# Altium project Gator Stream Transmitter.PrjPCB
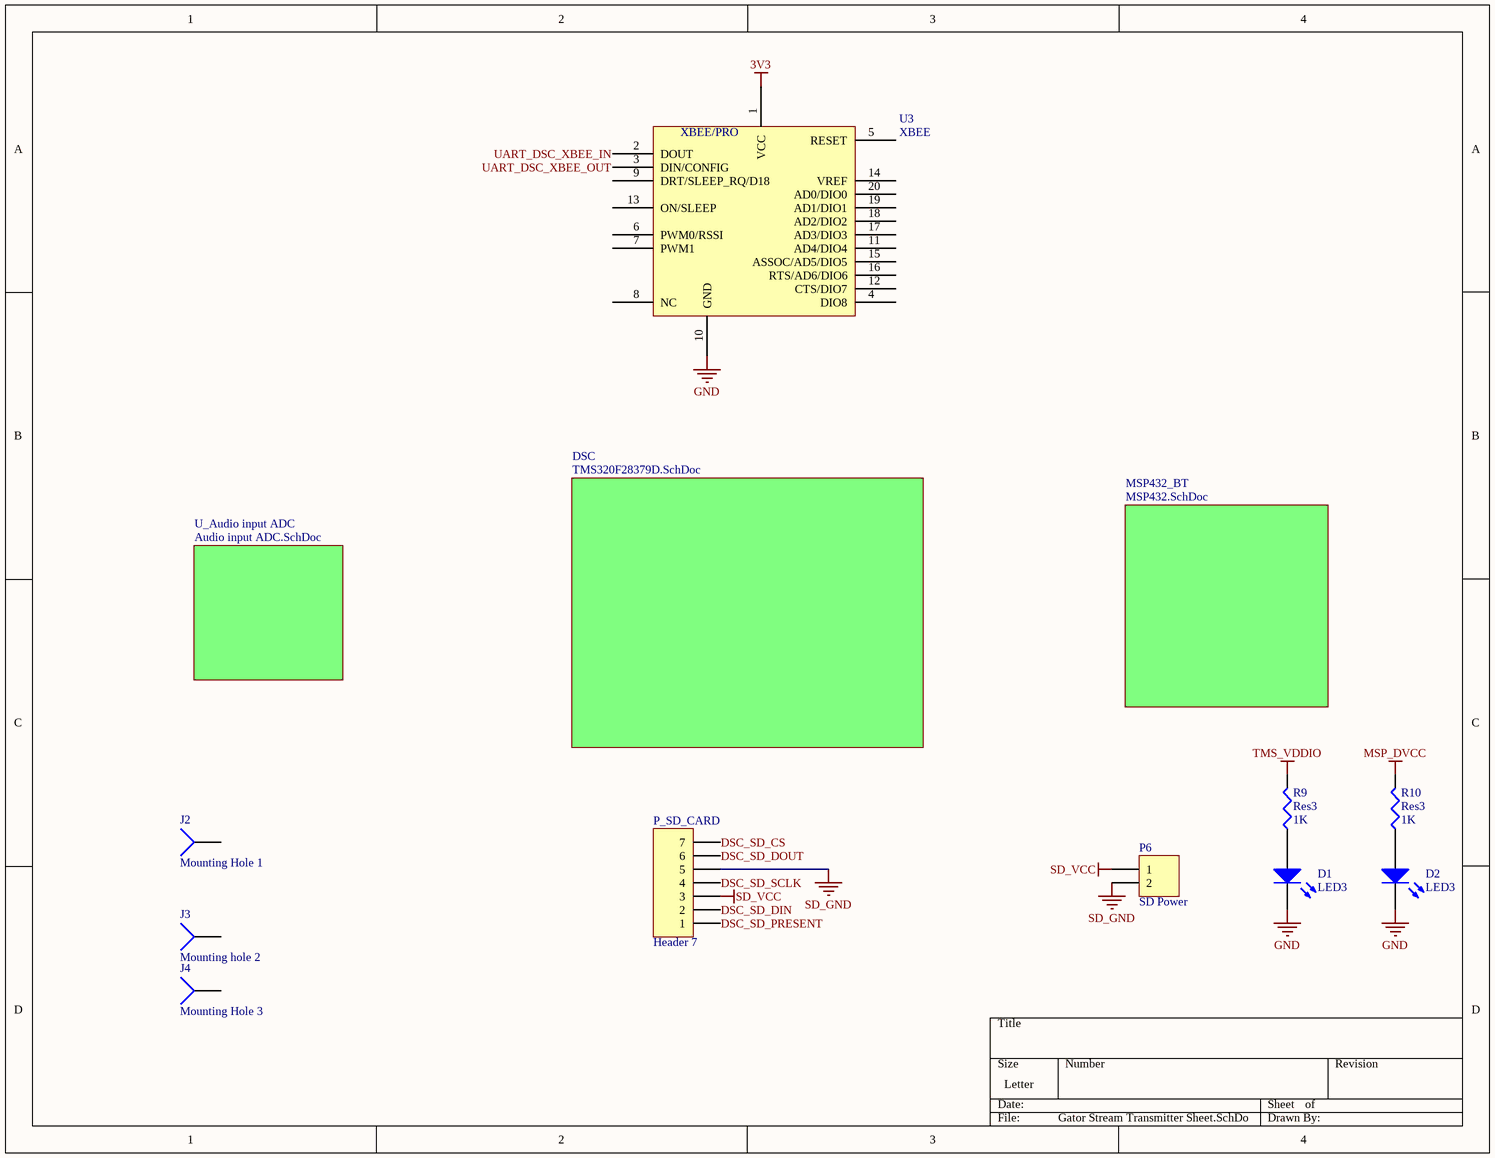
[diagram p0: Gator Stream Transmitter Sheet.SchDoc]
4 sheets, 80 parts. Net scope: global (net labels, ports and power ports of the same name join across sheets).
Board file: Gator Stream Transmitter.PcbDoc
Sheets:
  Gator Stream Transmitter Sheet.SchDoc
    MSP432_BT = MSP432.SchDoc
    DSC = TMS320F28379D.SchDoc
    U_Audio input ADC = Audio input ADC.SchDoc

## Sheet Gator Stream Transmitter Sheet.SchDoc
size Letter

### Parts
D1  LED3  [3.5X2.8X1.9]
D2  LED3  [3.5X2.8X1.9]
J2  Mounting Hole 1  [PIN1]
J3  Mounting hole 2  [PIN1]
J4  Mounting Hole 3  [PIN1]
P6  SD Power  [HDR1X2]
P_SD_CARD  Header 7  [HDR1X7]
R9  Res3  value 1K  [14-1210]
R10  Res3  value 1K  [14-1210]
U3  XBEE  [XBEE/PRO]

### Sub-sheets
DSC = TMS320F28379D.SchDoc: no entries
MSP432_BT = MSP432.SchDoc: no entries
U_Audio input ADC = Audio input ADC.SchDoc: no entries

### Nets
3V3: R10.2 U3.1(VCC)  [also labelled MSP_DVCC]
GND: D1.2(K) D2.2(K) U3.10(GND)
SD_GND: P6.2 P_SD_CARD.5
SD_VCC: P6.1 P_SD_CARD.3
TMS_VDDIO: R9.2
DSC_SD_CS: P_SD_CARD.7
DSC_SD_DIN: P_SD_CARD.2
DSC_SD_DOUT: P_SD_CARD.6
DSC_SD_PRESENT: P_SD_CARD.1
DSC_SD_SCLK: P_SD_CARD.4
UART_DSC_XBEE_IN: U3.2(DOUT)
UART_DSC_XBEE_OUT: U3.3(DIN/CONFIG)
NetD1_1: D1.1(A) R9.1
NetD2_1: D2.1(A) R10.1

Not connected (* = marked no-connect by the designer): J2 1; J3 1; J4 1; U3 4(DIO8) 5(RESET) 6(PWM0/RSSI) 7(PWM1) 8(NC) 9(DRT/SLEEP_RQ/D18) 11(AD4/DIO4) 12(CTS/DIO7) 13(ON/SLEEP) 14(VREF) 15(ASSOC/AD5/DIO5) 16(RTS/AD6/DIO6) 17(AD3/DIO3) 18(AD2/DIO2) 19(AD1/DIO1) 20(AD0/DIO0)

### Notes on the sheet
- (in symbol XBEE) XBEE/PRO

### Library data of the parts
D1 D2 = LED3: Typical BLUE SiC LED; Published: 8-Jun-2000; LatestRevisionDate: 17-Dec-2003; LatestRevisionNote: PCB Footprint replaced.; DatasheetVersion: 16-Apr-2002; PackageVersion: 16-Apr-2002; PackageReference: 3.5X2.8X1.9; Publisher: Altium Limited; PackageDescription: SM LED; 2 C-Bend Leads; Body 3.5 x 2.8 x 1.9 mm, inc leads (LxWxH typ)
J2-J4 = Socket: LatestRevisionDate: 17-Jul-2002; LatestRevisionNote: Re-released for DXP Platform.; Publisher: Altium Limited
P6 = Header 2: Header, 2-Pin; LatestRevisionDate: 17-Jul-2002; LatestRevisionNote: Re-released for DXP Platform.; Publisher: Altium Limited
P_SD_CARD = Header 7: Header, 7-Pin; LatestRevisionDate: 17-Jul-2002; LatestRevisionNote: Re-released for DXP Platform.; Publisher: Altium Limited
R9 R10 = Res3: Resistor; Published: 8-Jun-2000; LatestRevisionDate: 29-May-2009; LatestRevisionNote: IPC-7351 Footprint Added.; PackageReference: J1-0603; Publisher: Altium Limited; PackageDescription: Chip Resistor

## Sheet MSP432.SchDoc
size Letter
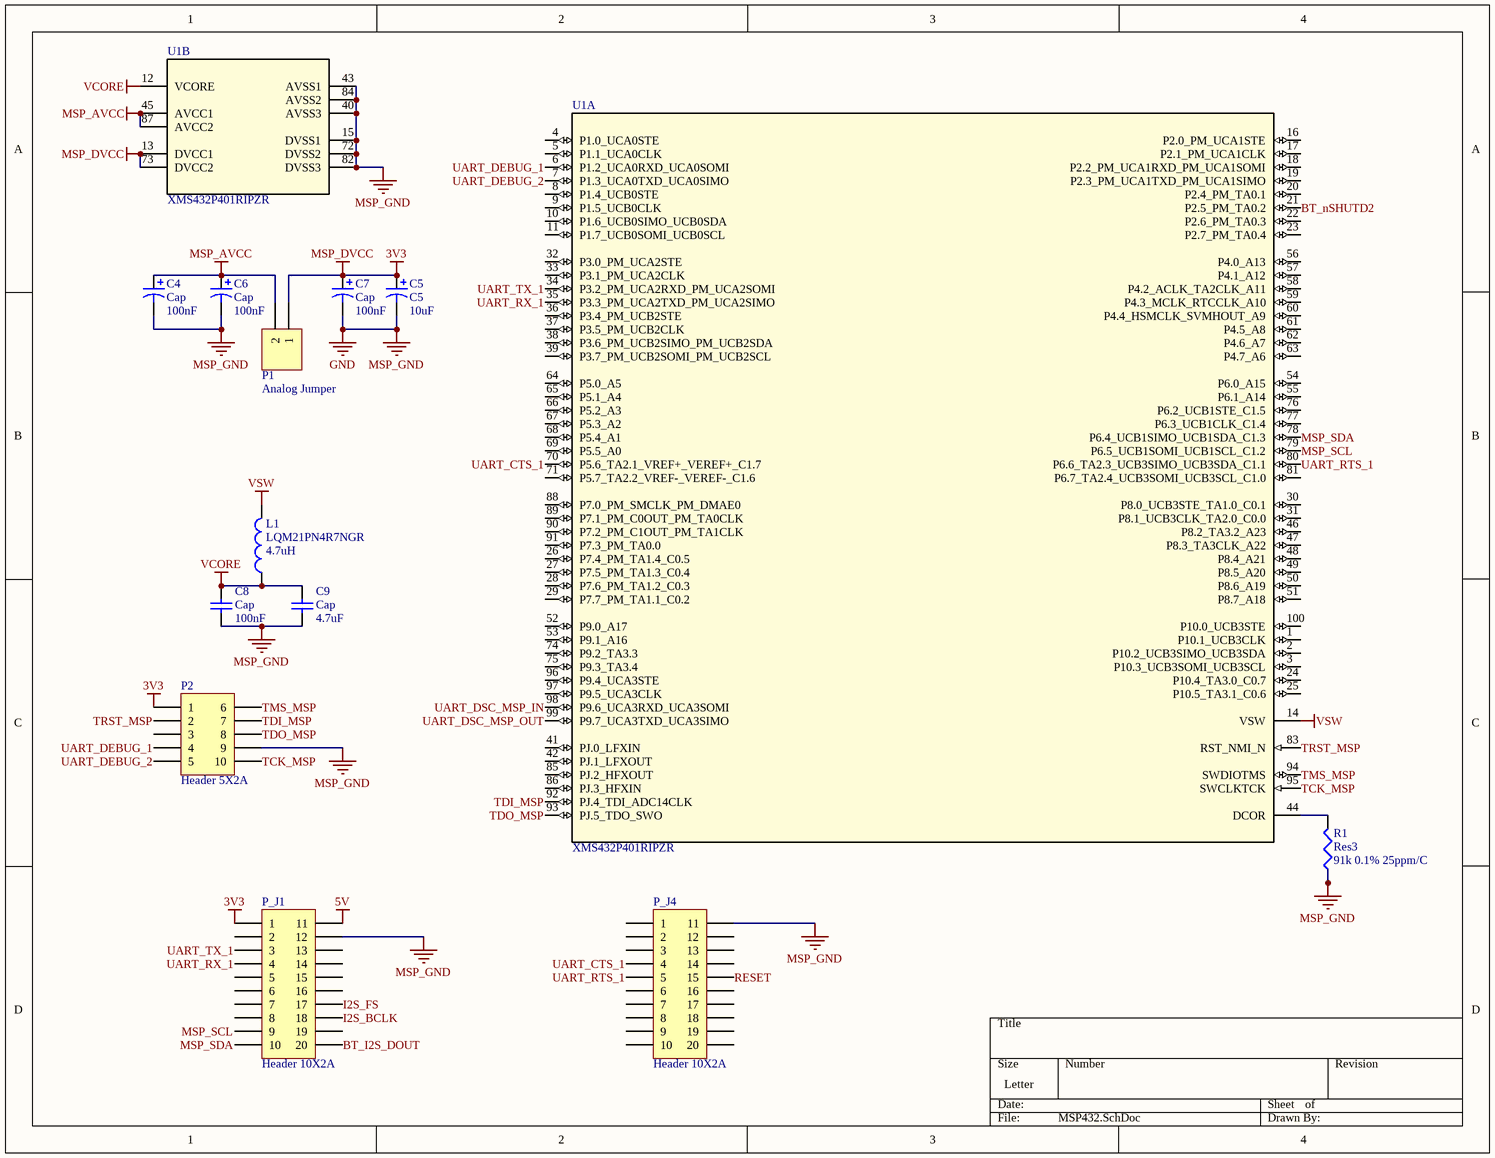
[diagram p1: MSP432.SchDoc]

### Parts
C4  Cap  value 100nF  [C0805]
C5  C5  value 10uF  [C0805]
C6  Cap  value 100nF  [C0805]
C7  Cap  value 100nF  [C0805]
C8  Cap  value 100nF  [C0805]
C9  Cap  value 4.7uF  [C0805]
L1  LQM21PN4R7NGR  value 4.7uH  [6-0805_N]
P1  Analog Jumper  [HDR1X2]
P2  Header 5X2A  [HDR2X5_CEN]
P_J1  Header 10X2A  [HDR2X10_CEN]
P_J4  Header 10X2A  [HDR2X10_CEN]
R1  Res3  value 91k 0.1% 25ppm/C  [14-1210]
U1  XMS432P401RIPZR  [PZ0100A_N]  (parts A,B of 2)

### Nets
3V3: C5.1 C7.1 P1.1 P2.1 P_J1.1 U1.13(DVCC1) U1.73(DVCC2)  [also labelled MSP_DVCC]
5V: P_J1.11
GND: C4.2 C5.2 C6.2 C7.2 C8.1 C9.2 P2.9 P_J1.12 P_J4.11 R1.1 U1.15(DVSS1) U1.40(AVSS3) U1.43(AVSS1) U1.72(DVSS2) U1.82(DVSS3) U1.84(AVSS2)  [also labelled MSP_GND]
MSP_AVCC: C4.1 C6.1 P1.2 U1.45(AVCC1) U1.87(AVCC2)
VCORE: C8.2 C9.1 L1.1 U1.12(VCORE)
VSW: L1.2 U1.14(VSW)
BT_I2S_DOUT: P_J1.20
BT_nSHUTD2: U1.21(P2.5_PM_TA0.2)
I2S_BCLK: P_J1.18
I2S_FS: P_J1.17
MSP_SCL: P_J1.9 U1.79(P6.5_UCB1SOMI_UCB1SCL_C1.2)
MSP_SDA: P_J1.10 U1.78(P6.4_UCB1SIMO_UCB1SDA_C1.3)
RESET: P_J4.15
TCK_MSP: P2.10 U1.95(SWCLKTCK)
TDI_MSP: P2.7 U1.92(PJ.4_TDI_ADC14CLK)
TDO_MSP: P2.8 U1.93(PJ.5_TDO_SWO)
TMS_MSP: P2.6 U1.94(SWDIOTMS)
TRST_MSP: P2.2 U1.83(RST_NMI_N)
UART_CTS_1: P_J4.4 U1.70(P5.6_TA2.1_VREF+_VEREF+_C1.7)
UART_DEBUG_1: P2.4 U1.6(P1.2_UCA0RXD_UCA0SOMI)
UART_DEBUG_2: P2.5 U1.7(P1.3_UCA0TXD_UCA0SIMO)
UART_DSC_MSP_IN: U1.98(P9.6_UCA3RXD_UCA3SOMI)
UART_DSC_MSP_OUT: U1.99(P9.7_UCA3TXD_UCA3SIMO)
UART_RTS_1: P_J4.5 U1.80(P6.6_TA2.3_UCB3SIMO_UCB3SDA_C1.1)
UART_RX_1: P_J1.4 U1.35(P3.3_PM_UCA2TXD_PM_UCA2SIMO)
UART_TX_1: P_J1.3 U1.34(P3.2_PM_UCA2RXD_PM_UCA2SOMI)
NetR1_2: R1.2 U1.44(DCOR)

Not connected (* = marked no-connect by the designer): P2 3; P_J1 2 5 6 7 8 13 14 15 16 19; P_J4 1 2 3 6 7 8 9 10 12 13 14 16 17 18 19 20; U1 1(P10.1_UCB3CLK) 2(P10.2_UCB3SIMO_UCB3SDA) 3(P10.3_UCB3SOMI_UCB3SCL) 4(P1.0_UCA0STE) 5(P1.1_UCA0CLK) 8(P1.4_UCB0STE) 9(P1.5_UCB0CLK) 10(P1.6_UCB0SIMO_UCB0SDA) 11(P1.7_UCB0SOMI_UCB0SCL) 16(P2.0_PM_UCA1STE) 17(P2.1_PM_UCA1CLK) 18(P2.2_PM_UCA1RXD_PM_UCA1SOMI) 19(P2.3_PM_UCA1TXD_PM_UCA1SIMO) 20(P2.4_PM_TA0.1) 22(P2.6_PM_TA0.3) 23(P2.7_PM_TA0.4) 24(P10.4_TA3.0_C0.7) 25(P10.5_TA3.1_C0.6) 26(P7.4_PM_TA1.4_C0.5) 27(P7.5_PM_TA1.3_C0.4) 28(P7.6_PM_TA1.2_C0.3) 29(P7.7_PM_TA1.1_C0.2) 30(P8.0_UCB3STE_TA1.0_C0.1) 31(P8.1_UCB3CLK_TA2.0_C0.0) 32(P3.0_PM_UCA2STE) 33(P3.1_PM_UCA2CLK) 36(P3.4_PM_UCB2STE) 37(P3.5_PM_UCB2CLK) 38(P3.6_PM_UCB2SIMO_PM_UCB2SDA) 39(P3.7_PM_UCB2SOMI_PM_UCB2SCL) 41(PJ.0_LFXIN) 42(PJ.1_LFXOUT) 46(P8.2_TA3.2_A23) 47(P8.3_TA3CLK_A22) 48(P8.4_A21) 49(P8.5_A20) 50(P8.6_A19) 51(P8.7_A18) 52(P9.0_A17) 53(P9.1_A16) 54(P6.0_A15) 55(P6.1_A14) 56(P4.0_A13) 57(P4.1_A12) 58(P4.2_ACLK_TA2CLK_A11) 59(P4.3_MCLK_RTCCLK_A10) 60(P4.4_HSMCLK_SVMHOUT_A9) 61(P4.5_A8) 62(P4.6_A7) 63(P4.7_A6) 64(P5.0_A5) 65(P5.1_A4) 66(P5.2_A3) 67(P5.3_A2) 68(P5.4_A1) 69(P5.5_A0) 71(P5.7_TA2.2_VREF-_VEREF-_C1.6) 74(P9.2_TA3.3) 75(P9.3_TA3.4) 76(P6.2_UCB1STE_C1.5) 77(P6.3_UCB1CLK_C1.4) 81(P6.7_TA2.4_UCB3SOMI_UCB3SCL_C1.0) 85(PJ.2_HFXOUT) 86(PJ.3_HFXIN) 88(P7.0_PM_SMCLK_PM_DMAE0) 89(P7.1_PM_C0OUT_PM_TA0CLK) 90(P7.2_PM_C1OUT_PM_TA1CLK) 91(P7.3_PM_TA0.0) 96(P9.4_UCA3STE) 97(P9.5_UCA3CLK) 100(P10.0_UCB3STE)

### Library data of the parts
C4-C7 = Cap Pol3: Polarized Capacitor (Surface Mount); Published: 8-Jun-2000; LatestRevisionDate: 29-May-2009; LatestRevisionNote: IPC-7351 Footprint Added.; PackageReference: C0805; Publisher: Altium Limited; PackageDescription: Chip Capacitor
C8 C9 = Cap Semi: Capacitor (Semiconductor SIM Model); Published: 8-Jun-2000; LatestRevisionDate: 29-May-2009; LatestRevisionNote: IPC-7351 Footprint Added.; PackageReference: C1206; Publisher: Altium Limited; PackageDescription: Chip Capacitor
L1 = Inductor: Code_IEC: 1005; Published: 8-Jun-2000; LatestRevisionDate: 29-May-2009; LatestRevisionNote: IPC-7351 Footprint Added.; PackageReference: 0402-A; Publisher: Altium Limited; PackageDescription: Chip Inductor; Code_JEITA: 0402
P1 = Header 2: Header, 2-Pin; LatestRevisionDate: 17-Jul-2002; LatestRevisionNote: Re-released for DXP Platform.; Publisher: Altium Limited
P2 = Header 5X2A: Header, 5-Pin, Dual row; LatestRevisionDate: 17-Jul-2002; LatestRevisionNote: Re-released for DXP Platform.; Publisher: Altium Limited
P_J1 P_J4 = Header 10X2A: Header, 10-Pin, Dual row; LatestRevisionDate: 17-Jul-2002; LatestRevisionNote: Re-released for DXP Platform.; Publisher: Altium Limited
R1 = Res3: Resistor; Published: 8-Jun-2000; LatestRevisionDate: 29-May-2009; LatestRevisionNote: IPC-7351 Footprint Added.; PackageReference: J1-0603; Publisher: Altium Limited; PackageDescription: Chip Resistor
U1 = XMS432P401RIPZR: Imported; Manufacturer: Texas Instruments; CompType: IC; PIN_COUNT: 100; PartNumber: XMS432P401RIPZR; PackageReference: PZ0100A; MountType: SMT; RefDes: RefDes; TYPE: TYPE; Value: Value

## Sheet TMS320F28379D.SchDoc
size Letter
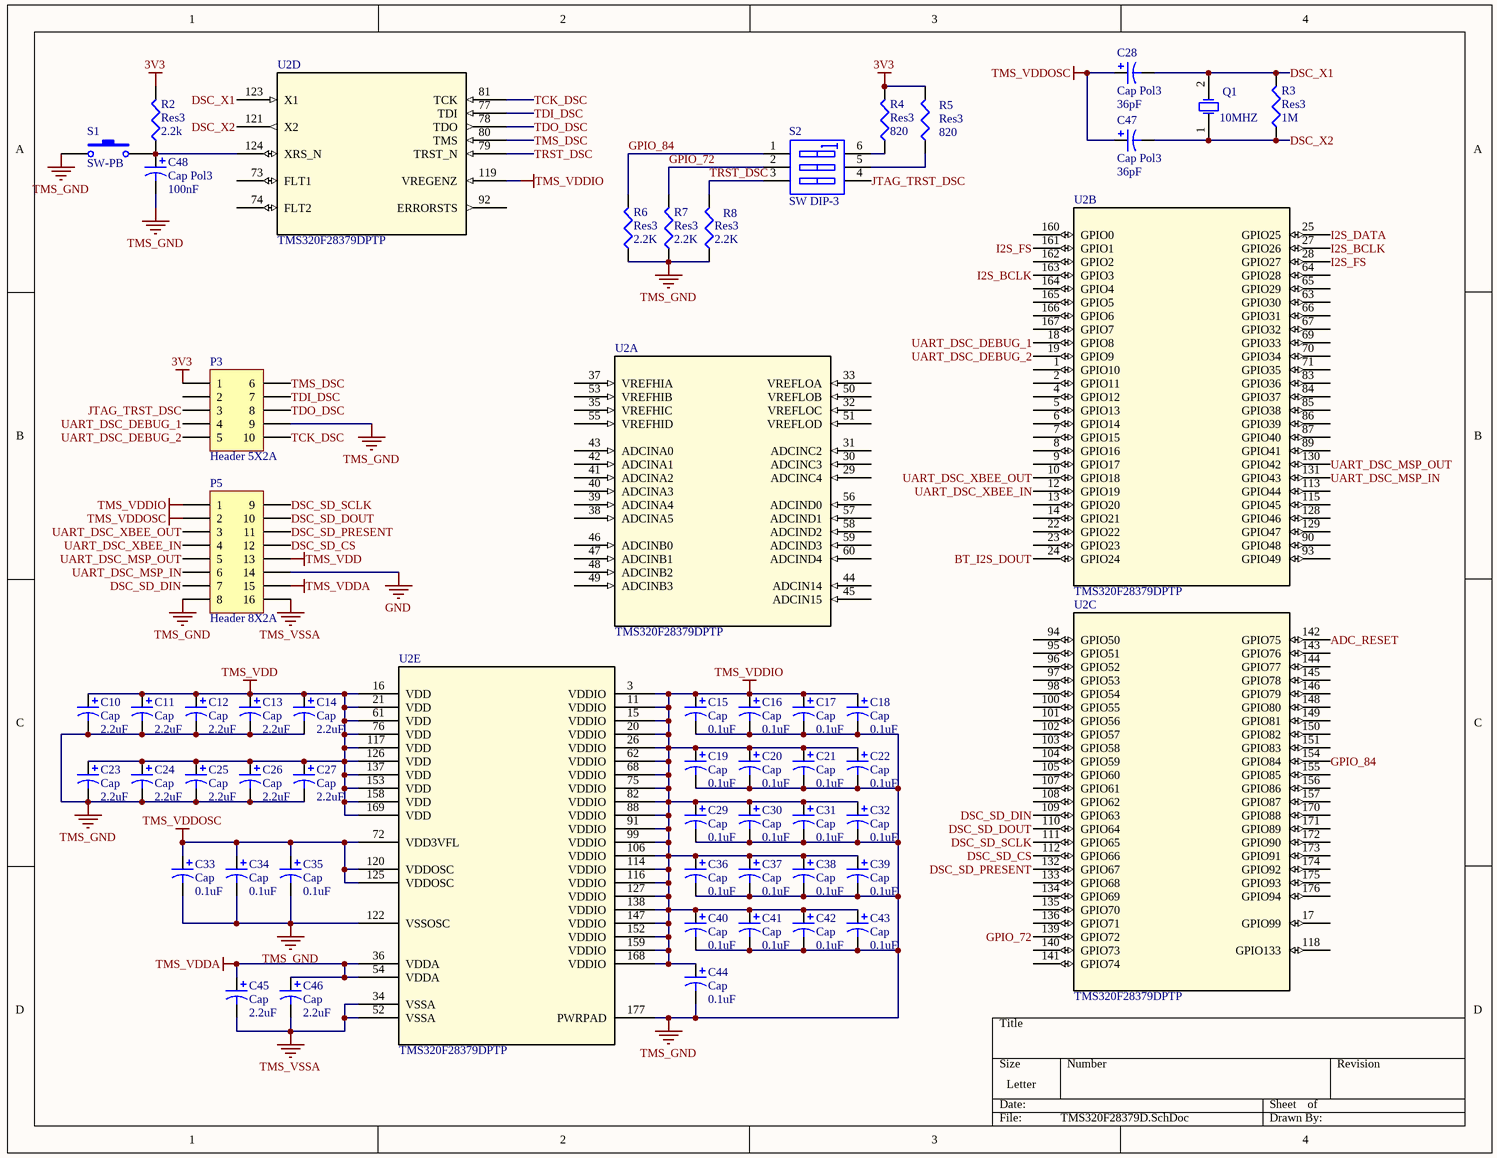
[diagram p2: TMS320F28379D.SchDoc]

### Parts
C10  Cap  value 2.2uF  [C0805]
C11  Cap  value 2.2uF  [C0805]
C12  Cap  value 2.2uF  [C0805]
C13  Cap  value 2.2uF  [C0805]
C14  Cap  value 2.2uF  [C0805]
C15  Cap  value 0.1uF  [C0805]
C16  Cap  value 0.1uF  [C0805]
C17  Cap  value 0.1uF  [C0805]
C18  Cap  value 0.1uF  [C0805]
C19  Cap  value 0.1uF  [C0805]
C20  Cap  value 0.1uF  [C0805]
C21  Cap  value 0.1uF  [C0805]
C22  Cap  value 0.1uF  [C0805]
C23  Cap  value 2.2uF  [C0805]
C24  Cap  value 2.2uF  [C0805]
C25  Cap  value 2.2uF  [C0805]
C26  Cap  value 2.2uF  [C0805]
C27  Cap  value 2.2uF  [C0805]
C28  Cap Pol3  value 36pF  [C0805]
C29  Cap  value 0.1uF  [C0805]
C30  Cap  value 0.1uF  [C0805]
C31  Cap  value 0.1uF  [C0805]
C32  Cap  value 0.1uF  [C0805]
C33  Cap  value 0.1uF  [C0805]
C34  Cap  value 0.1uF  [C0805]
C35  Cap  value 0.1uF  [C0805]
C36  Cap  value 0.1uF  [C0805]
C37  Cap  value 0.1uF  [C0805]
C38  Cap  value 0.1uF  [C0805]
C39  Cap  value 0.1uF  [C0805]
C40  Cap  value 0.1uF  [C0805]
C41  Cap  value 0.1uF  [C0805]
C42  Cap  value 0.1uF  [C0805]
C43  Cap  value 0.1uF  [C0805]
C44  Cap  value 0.1uF  [C0805]
C45  Cap  value 2.2uF  [C0805]
C46  Cap  value 2.2uF  [C0805]
C47  Cap Pol3  value 36pF  [C0805]
C48  Cap Pol3  value 100nF  [C0805]
P3  Header 5X2A  [HDR2X5_CEN]
P5  Header 8X2A  [HDR2X8_CEN]
Q1  10MHZ  [HC-49U]
R2  Res3  value 2.2k  [14-1210]
R3  Res3  value 1M  [14-1210]
R4  Res3  value 820  [14-1210]
R5  Res3  value 820  [14-1210]
R6  Res3  value 2.2K  [14-1210]
R7  Res3  value 2.2K  [14-1210]
R8  Res3  value 2.2K  [14-1210]
S1  SW-PB  [SW PB]
S2  SW DIP-3  [DIP-6]
U2  TMS320F28379DPTP  [PTP0176F_N]  (parts A,B,C,D,E of 5)

### Nets
3V3: P3.1 R2.2 R4.2 R5.2
GND: P5.14
TMS_GND: C10.2 C11.2 C12.2 C13.2 C14.2 C15.2 C16.2 C17.2 C18.2 C19.2 C20.2 C21.2 C22.2 C23.2 C24.2 C25.2 C26.2 C27.2 C29.2 C30.2 C31.2 C32.2 C33.2 C34.2 C35.2 C36.2 C37.2 C38.2 C39.2 C40.2 C41.2 C42.2 C43.2 C44.2 C48.2 P3.9 P5.8 R6.1 R7.1 R8.1 S1.1 U2.122(VSSOSC) U2.177(PWRPAD)
TMS_VDD: C10.1 C11.1 C12.1 C13.1 C14.1 C23.1 C24.1 C25.1 C26.1 C27.1 P5.13 U2.16(VDD) U2.21(VDD) U2.61(VDD) U2.76(VDD) U2.117(VDD) U2.126(VDD) U2.137(VDD) U2.153(VDD) U2.158(VDD) U2.169(VDD)
TMS_VDDA: C45.1 C46.1 P5.15 U2.36(VDDA) U2.54(VDDA)
TMS_VDDIO: C15.1 C16.1 C17.1 C18.1 C19.1 C20.1 C21.1 C22.1 C29.1 C30.1 C31.1 C32.1 C36.1 C37.1 C38.1 C39.1 C40.1 C41.1 C42.1 C43.1 C44.1 P5.1 U2.3(VDDIO) U2.11(VDDIO) U2.15(VDDIO) U2.20(VDDIO) U2.26(VDDIO) U2.62(VDDIO) U2.68(VDDIO) U2.75(VDDIO) U2.82(VDDIO) U2.88(VDDIO) U2.91(VDDIO) U2.99(VDDIO) U2.106(VDDIO) U2.114(VDDIO) U2.116(VDDIO) U2.119(VREGENZ) U2.127(VDDIO) U2.138(VDDIO) U2.147(VDDIO) U2.152(VDDIO) U2.159(VDDIO) U2.168(VDDIO)
TMS_VDDOSC: C28.1 C33.1 C34.1 C35.1 C47.1 P5.2 U2.72(VDD3VFL) U2.120(VDDOSC) U2.125(VDDOSC)
TMS_VSSA: C45.2 C46.2 P5.16 U2.34(VSSA) U2.52(VSSA)
ADC_RESET: U2.142(GPIO75)
BT_I2S_DOUT: U2.24(GPIO24)
DSC_SD_CS: P5.12 U2.112(GPIO66)
DSC_SD_DIN: P5.7 U2.109(GPIO63)
DSC_SD_DOUT: P5.10 U2.110(GPIO64)
DSC_SD_PRESENT: P5.11 U2.132(GPIO67)
DSC_SD_SCLK: P5.9 U2.111(GPIO65)
DSC_X1: C28.2 Q1.2(OSC2) R3.2 U2.123(X1)
DSC_X2: C47.2 Q1.1(OSC1) R3.1 U2.121(X2)
GPIO_72: R7.2 S2.2(A2) U2.139(GPIO72)
GPIO_84: R6.2 S2.1(A1) U2.154(GPIO84)
I2S_BCLK: U2.27(GPIO26) U2.163(GPIO3)
I2S_DATA: U2.25(GPIO25)
I2S_FS: U2.28(GPIO27) U2.161(GPIO1)
JTAG_TRST_DSC: P3.3 S2.4(B3)
TCK_DSC: P3.10 U2.81(TCK)
TDI_DSC: P3.7 U2.77(TDI)
TDO_DSC: P3.8 U2.78(TDO)
TMS_DSC: P3.6 U2.80(TMS)
TRST_DSC: R8.2 S2.3(A3) U2.79(TRST_N)
UART_DSC_DEBUG_1: P3.4 U2.18(GPIO8)
UART_DSC_DEBUG_2: P3.5 U2.19(GPIO9)
UART_DSC_MSP_IN: P5.6 U2.131(GPIO43)
UART_DSC_MSP_OUT: P5.5 U2.130(GPIO42)
UART_DSC_XBEE_IN: P5.4 U2.12(GPIO19)
UART_DSC_XBEE_OUT: P5.3 U2.10(GPIO18)
NetC48_1: C48.1 R2.1 S1.2 U2.124(XRS_N)
NetR4_1: R4.1 S2.6(B1)
NetR5_1: R5.1 S2.5(B2)

Not connected (* = marked no-connect by the designer): P3 2; U2 1(GPIO10) 2(GPIO11) 4(GPIO12) 5(GPIO13) 6(GPIO14) 7(GPIO15) 8(GPIO16) 9(GPIO17) 13(GPIO20) 14(GPIO21) 17(GPIO99) 22(GPIO22) 23(GPIO23) 29(ADCINC4) 30(ADCINC3) 31(ADCINC2) 32(VREFLOC) 33(VREFLOA) 35(VREFHIC) 37(VREFHIA) 38(ADCINA5) 39(ADCINA4) 40(ADCINA3) 41(ADCINA2) 42(ADCINA1) 43(ADCINA0) 44(ADCIN14) 45(ADCIN15) 46(ADCINB0) 47(ADCINB1) 48(ADCINB2) 49(ADCINB3) 50(VREFLOB) 51(VREFLOD) 53(VREFHIB) 55(VREFHID) 56(ADCIND0) 57(ADCIND1) 58(ADCIND2) 59(ADCIND3) 60(ADCIND4) 63(GPIO30) 64(GPIO28) 65(GPIO29) 66(GPIO31) 67(GPIO32) 69(GPIO33) 70(GPIO34) 71(GPIO35) 73(FLT1) 74(FLT2) 83(GPIO36) 84(GPIO37) 85(GPIO38) 86(GPIO39) 87(GPIO40) 89(GPIO41) 90(GPIO48) 92(ERRORSTS) 93(GPIO49) 94(GPIO50) 95(GPIO51) 96(GPIO52) 97(GPIO53) 98(GPIO54) 100(GPIO55) 101(GPIO56) 102(GPIO57) 103(GPIO58) 104(GPIO59) 105(GPIO60) 107(GPIO61) 108(GPIO62) 113(GPIO44) 115(GPIO45) 118(GPIO133) 128(GPIO46) 129(GPIO47) 133(GPIO68) 134(GPIO69) 135(GPIO70) 136(GPIO71) 140(GPIO73) 141(GPIO74) 143(GPIO76) 144(GPIO77) 145(GPIO78) 146(GPIO79) 148(GPIO80) 149(GPIO81) 150(GPIO82) 151(GPIO83) 155(GPIO85) 156(GPIO86) 157(GPIO87) 160(GPIO0) 162(GPIO2) 164(GPIO4) 165(GPIO5) 166(GPIO6) 167(GPIO7) 170(GPIO88) 171(GPIO89) 172(GPIO90) 173(GPIO91) 174(GPIO92) 175(GPIO93) 176(GPIO94)

### Library data of the parts
C10-C48 = Cap Pol3: Polarized Capacitor (Surface Mount); Published: 8-Jun-2000; LatestRevisionDate: 29-May-2009; LatestRevisionNote: IPC-7351 Footprint Added.; PackageReference: C0805; Publisher: Altium Limited; PackageDescription: Chip Capacitor
P3 = Header 5X2A: Header, 5-Pin, Dual row; LatestRevisionDate: 17-Jul-2002; LatestRevisionNote: Re-released for DXP Platform.; Publisher: Altium Limited
P5 = Header 8X2A: Header, 8-Pin, Dual row; LatestRevisionDate: 17-Jul-2002; LatestRevisionNote: Re-released for DXP Platform.; Publisher: Altium Limited
Q1 = ECS-10-13-1: Crystal Oscillator; Published: 17-Jul-2002; DatasheetDocument: 18-Apr-2000; PackageReference: HC-49U; Publisher: Altium Limited; ComponentLink1Description: Manufacturer Link; ComponentLink1URL: http://www.ecsxtal.com/; ComponentLink2Description: Datasheet; ComponentLink2URL: http://www.ecsxtal.com/pdf2/HC49U.PDF
R2-R8 = Res3: Resistor; Published: 8-Jun-2000; LatestRevisionDate: 29-May-2009; LatestRevisionNote: IPC-7351 Footprint Added.; PackageReference: J1-0603; Publisher: Altium Limited; PackageDescription: Chip Resistor
S1 = SW-PB_2: DIGIKEY SW400-ND; Published: 24-Mar-1999; LatestRevisionDate: 17-Jul-2002; LatestRevisionNote: Re-released for DXP Platform.; Publisher: Altium Limited
S2 = SW DIP-3: DIP Switch, 3 Position, SPST; Published: 24-Mar-1999; LatestRevisionDate: 17-Jul-2002; LatestRevisionNote: Re-released for DXP Platform.; PackageReference: DIP-6; Publisher: Altium Limited; Code_JEDEC: MO-001-AM
U2 = TMS320F28379DPTP: Imported; PartNumber: TMS320F28379DPTPS; Manufacturer: Texas Instruments; RefDes: RefDes; TYPE: TYPE; Value: Value

## Sheet Audio input ADC.SchDoc
size A
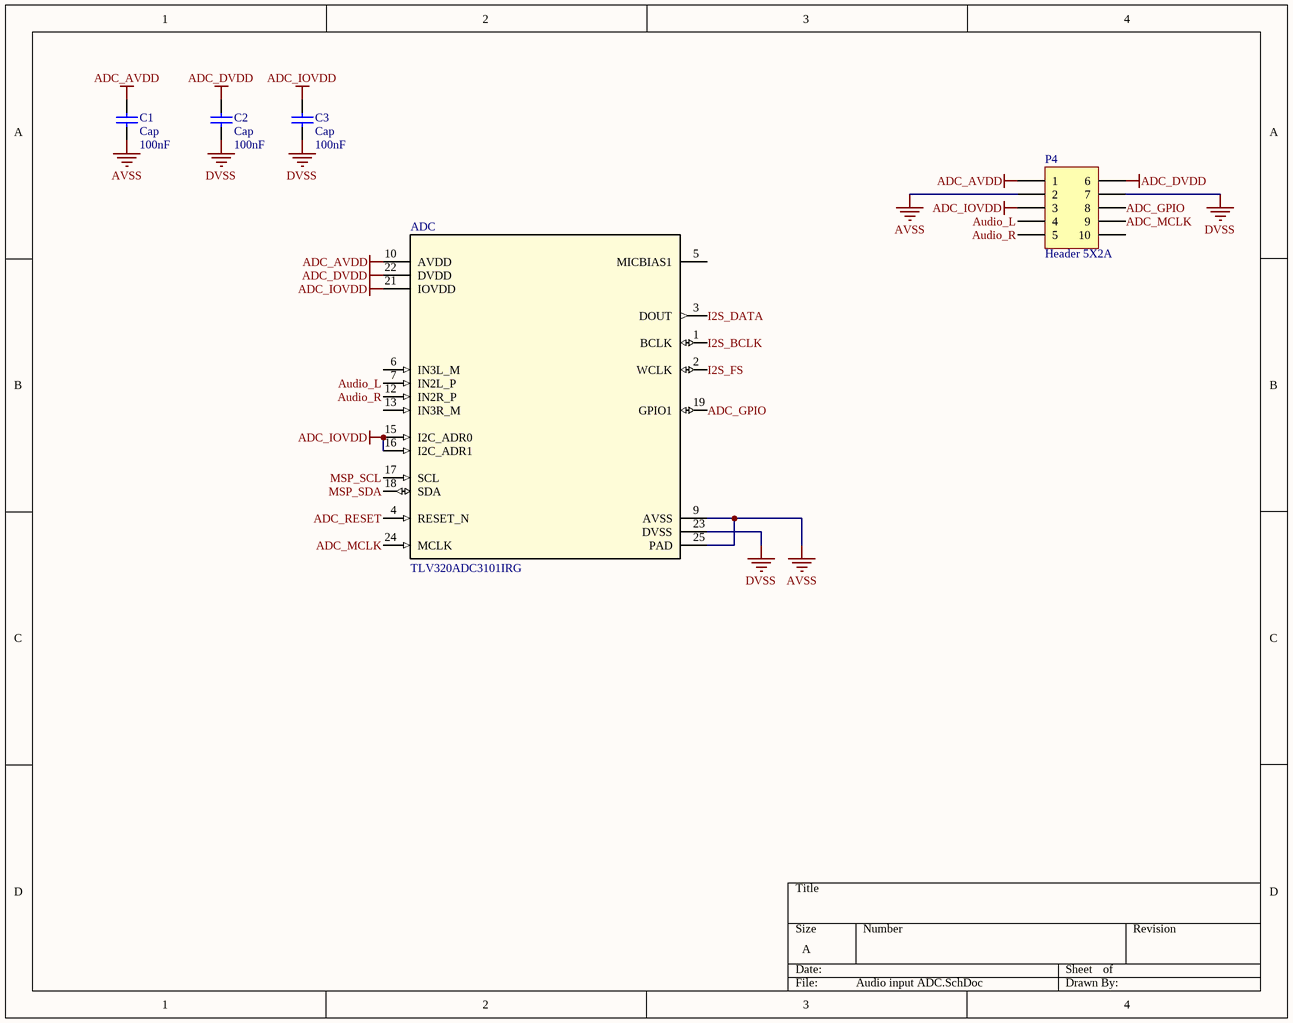
[diagram p3: Audio input ADC.SchDoc]

### Parts
ADC  TLV320ADC3101IRG  [RGE0024F_NV]
C1  Cap  value 100nF  [RAD-0.3]
C2  Cap  value 100nF  [RAD-0.3]
C3  Cap  value 100nF  [RAD-0.3]
P4  Header 5X2A  [HDR2X5_CEN]

### Nets
ADC_AVDD: ADC.10(AVDD) C1.2 P4.1
ADC_DVDD: ADC.22(DVDD) C2.2 P4.6
ADC_IOVDD: ADC.15(I2C_ADR0) ADC.16(I2C_ADR1) ADC.21(IOVDD) C3.2 P4.3
AVSS: ADC.9(AVSS) ADC.25(PAD) C1.1 P4.2
DVSS: ADC.23(DVSS) C2.1 C3.1 P4.7
ADC_GPIO: ADC.19(GPIO1) P4.8
ADC_MCLK: ADC.24(MCLK) P4.9
ADC_RESET: ADC.4(RESET_N)
Audio_L: ADC.7(IN2L_P) P4.4
Audio_R: ADC.12(IN2R_P) P4.5
I2S_BCLK: ADC.1(BCLK)
I2S_DATA: ADC.3(DOUT)
I2S_FS: ADC.2(WCLK)
MSP_SCL: ADC.17(SCL)
MSP_SDA: ADC.18(SDA)

Not connected (* = marked no-connect by the designer): ADC 5(MICBIAS1) 6(IN3L_M) 13(IN3R_M); P4 10

### Library data of the parts
ADC = TLV320ADC3101IRG: Imported; Manufacturer: Texas Instruments; PartNumber: TLV320ADC3101IRGER; RefDes: RefDes; TYPE: TYPE; Value: Value
C1-C3 = Cap: Capacitor; Published: 8-Jun-2000; LatestRevisionDate: 17-Jul-2002; LatestRevisionNote: Re-released for DXP Platform.; PackageReference: RAD-0.3; Publisher: Altium Limited; PackageDescription: Radial Cap, Thru-Hole; 2 Leads; 0.3 in Pin Spacing
P4 = Header 5X2A: Header, 5-Pin, Dual row; LatestRevisionDate: 17-Jul-2002; LatestRevisionNote: Re-released for DXP Platform.; Publisher: Altium Limited

## Nets that join several sheets
3V3: Gator Stream Transmitter Sheet (R10.2 U3.1), MSP432 (7 pins), TMS320F28379D (P3.1 R2.2 R4.2 R5.2)
GND: Gator Stream Transmitter Sheet (D1.2 D2.2 U3.10), MSP432 (16 pins), TMS320F28379D (P5.14)
TMS_VDDIO: Gator Stream Transmitter Sheet (R9.2), TMS320F28379D (44 pins)
ADC_RESET: TMS320F28379D (U2.142), Audio input ADC (ADC.4)
BT_I2S_DOUT: MSP432 (P_J1.20), TMS320F28379D (U2.24)
DSC_SD_CS: Gator Stream Transmitter Sheet (P_SD_CARD.7), TMS320F28379D (P5.12 U2.112)
DSC_SD_DIN: Gator Stream Transmitter Sheet (P_SD_CARD.2), TMS320F28379D (P5.7 U2.109)
DSC_SD_DOUT: Gator Stream Transmitter Sheet (P_SD_CARD.6), TMS320F28379D (P5.10 U2.110)
DSC_SD_PRESENT: Gator Stream Transmitter Sheet (P_SD_CARD.1), TMS320F28379D (P5.11 U2.132)
DSC_SD_SCLK: Gator Stream Transmitter Sheet (P_SD_CARD.4), TMS320F28379D (P5.9 U2.111)
I2S_BCLK: MSP432 (P_J1.18), TMS320F28379D (U2.27 U2.163), Audio input ADC (ADC.1)
I2S_DATA: TMS320F28379D (U2.25), Audio input ADC (ADC.3)
I2S_FS: MSP432 (P_J1.17), TMS320F28379D (U2.28 U2.161), Audio input ADC (ADC.2)
MSP_SCL: MSP432 (P_J1.9 U1.79), Audio input ADC (ADC.17)
MSP_SDA: MSP432 (P_J1.10 U1.78), Audio input ADC (ADC.18)
UART_DSC_MSP_IN: MSP432 (U1.98), TMS320F28379D (P5.6 U2.131)
UART_DSC_MSP_OUT: MSP432 (U1.99), TMS320F28379D (P5.5 U2.130)
UART_DSC_XBEE_IN: Gator Stream Transmitter Sheet (U3.2), TMS320F28379D (P5.4 U2.12)
UART_DSC_XBEE_OUT: Gator Stream Transmitter Sheet (U3.3), TMS320F28379D (P5.3 U2.10)